# EAGLE design mbedshield037 (EAGLE 7.5.0)
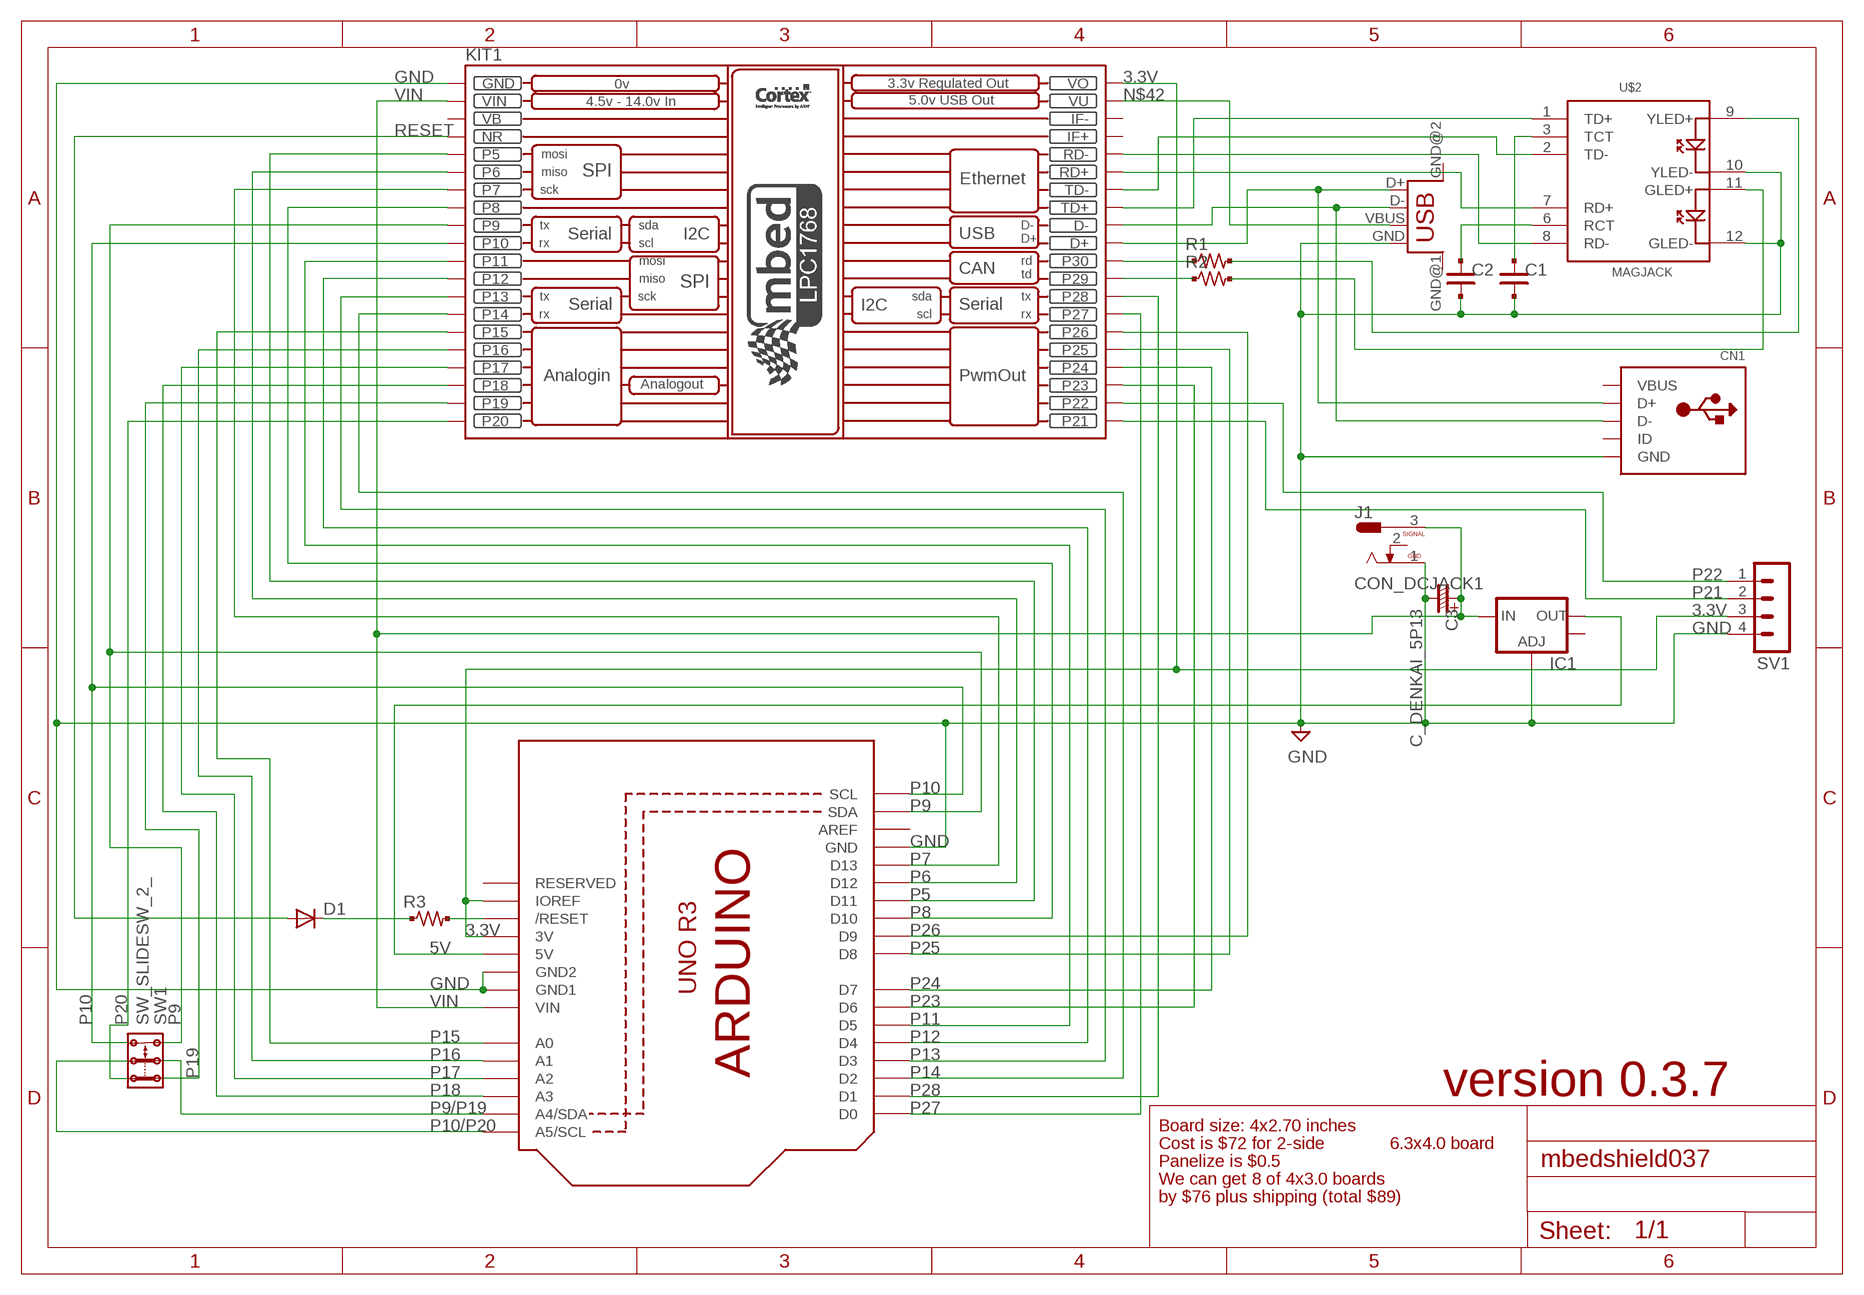
[diagram p0: schematic, sheet 1]

## Parts
C1  C_PAD_PAD_2125  [CR_2125]
C2  C_PAD_PAD_2125  [CR_2125]
C3  C_DENKAI_5P13  C_DENKAI_2.5P6  [C_2.5PHI6]
CN1  USBMINIB  [USB-MINIB]
D1  DIODE_SMALL_FLAT_2V  [DIODE_2125_2VIA]
IC1  V_REG_LM1117SOT223  [SOT223]
J1  CON_DCJACK1  [CON_DCJACK]
KIT1  MBED_NXP_LPC1768  [MBED-KIT]
R1  R_US_PAD_PAD_1608  [R_1608_PADPAD]
R2  R_US_PAD_PAD_1608  [R_1608_PADPAD]
R3  R_US_PAD_PAD_1608  [R_1608_PADPAD]
SV1  MA04-1  [MA04-1]
SW1  SW_SLIDESW_2_  [SW_SLIDE_2X2_1]
U1  ARDUINOR3-DIMENSION  [ARDUINOR3]
U$2  MAGJACK  [MAGJACK]
USB  USB  [USB-FEMALE-A-PTH]

## Nets
3.3V: KIT1.VOUT(VO) SV1.3 U1.3V U1.IOREF
5V: IC1.2(OUT) U1.5V
GND: C1.2 C2.2 C3.- CN1.GND IC1.1(ADJ) J1.1 KIT1.GND SV1.4 U1.GND U1.GND1 U1.GND2 U$2.10(YLED-) U$2.12(GLED-) USB.GND
N$27: D1.K(C) R3.1
N$28: R3.2 U1.RESET(/RESET)
N$29: C1.1 U$2.3(TCT)
N$30: C2.1 U$2.6(RCT)
N$31: KIT1.RD+ U$2.7(RD+)
N$32: KIT1.RD- U$2.8(RD-)
N$33: KIT1.TD- U$2.2(TD-)
N$34: KIT1.TD+ U$2.1(TD+)
N$36: KIT1.P$30(P30) R1.1
N$37: KIT1.P$29(P29) R2.1
N$39: R1.2 U$2.9(YLED+)
N$40: R2.2 U$2.11(GLED+)
N$42: KIT1.VU USB.VBUS
N$44: CN1.D- KIT1.D- USB.D-
N$45: CN1.D+ KIT1.D+ USB.D+
P5: KIT1.P$5(P5) U1.D11
P6: KIT1.P$6(P6) U1.D12
P7: KIT1.P$7(P7) U1.D13
P8: KIT1.P$8(P8) U1.D10
P9: KIT1.P$9(P9) SW1.2.1 U1.SDA
P9/P19: SW1.COM.1 U1.A4(A4/SDA)
P10: KIT1.P$10(P10) SW1.2.2 U1.SCL
P10/P20: SW1.COM.2 U1.A5(A5/SCL)
P11: KIT1.P$11(P11) U1.D5
P12: KIT1.P$12(P12) U1.D4
P13: KIT1.P$13(P13) U1.D3
P14: KIT1.P$14(P14) U1.D2
P15: KIT1.P$15(P15) U1.A0
P16: KIT1.P$16(P16) U1.A1
P17: KIT1.P$17(P17) U1.A2
P18: KIT1.P$18(P18) U1.A3
P19: KIT1.P$19(P19) SW1.1.1
P20: KIT1.P$20(P20) SW1.1.2
P21: KIT1.P$21(P21) SV1.2
P22: KIT1.P$22(P22) SV1.1
P23: KIT1.P$23(P23) U1.D6
P24: KIT1.P$24(P24) U1.D7
P25: KIT1.P$25(P25) U1.D8
P26: KIT1.P$26(P26) U1.D9
P27: KIT1.P$27(P27) U1.D0
P28: KIT1.P$28(P28) U1.D1
RESET: D1.A KIT1.NR
VIN: C3.+ IC1.3(IN) J1.3 KIT1.VIN U1.VIN
Unconnected: CN1.ID IC1.4(OUT) J1.2 KIT1.IF+ KIT1.IF- U1.AREF U1.RESERVED USB.GND@1(GND) USB.GND@2(GND)

## Notes on the sheet
- version 0.3.7
- Board size: 4x2.70 inches
- Cost is $72 for 2-side | 6.3x4.0 board
- Panelize is $0.5
- We can get 8 of 4x3.0 boards
- by $76 plus shipping (total $89)

## Power pins joined to a net without a drawn wire
VB: KIT1.VB
VBUS: CN1.VBUS

## Library data of the parts
C1 C2 = mylib:C_PAD_PAD_: SMD CAPACITOR : PAD - PAD
C3 = mylib:C_DENKAI: (Device name) : (Main function of the device) Packages : (Variant name1) : (Pitch) x (Pin) x (Width) (Variant name2) : (Pitch) x (Pin) x (Width) (Variant name3) : (Pitch) x (Pin) x (Width) ...
CN1 = adafruit (1):USB: USB Connectors USBMINIB - Surface Mount Female Mini-B USB Connector 4UConnector: 06564 By microbuilder.eu Thru-hole RA Female Mini-B USB Connector 4UConnector: 18732 By ladyada.net
D1 = mylib:DIODE_SMALL: DIODE high speed (Philips)
IC1 = SparkFun:V_REG_LM1117: Voltage Regulator LM1117 Standard adjustable voltage regulator but in SMD form. Spark Fun Electronics SKU : COM-00595
J1 = mylib:CON_DCJACK: DC JACK : 2.1 / 2.5 mm
KIT1 = MBED_v2.1:MBED_NXP_LPC1768: Mbed LPC1768 - ARM CORTEX v2.1 * Schematic symbol is now placed in eagles's default raster. *The pads diameter are suitable for routing between mbed pins * mbed pads are 0.8 mm drill diameter. --------------------------------------------- Created by: Mohamed Yousry *Alexandria, Egypt *Email: mohamed.yousry@ieeegoldegypt.org
R1-R3 = mylib:R_US_PAD_PAD: R_US_PAD_PAD : SMD R PAD is NTH-NTH Packages : _1608 : 1.6 x 0.8 mm _2125 : 2.0 x 1.25 mm _3216 : 3.2 x 1.6 mm
SV1 = con-lstb:MA04-1: PIN HEADER; OC_FARNELL: unknown; OC_NEWARK: unknown
SW1 = mylib:SW_SLIDESW_2_
U1 = adafruit (1):ARDUINOR3: This is a new object for the new Arduino R3 - with extra pins that you may want to use (such as IOref, and duplicated A4/A5
U$2 = SparkFun:MAGJACK
USB = STUNTAZ:USB: USB Connectors USB-FEMALE-A-PTH: Through hole Female Type A Connector

## Net classes
0 signal: width 0.406 mm, drill 0.381 mm
1 power: width 0.813 mm, drill 0.381 mm

## Board
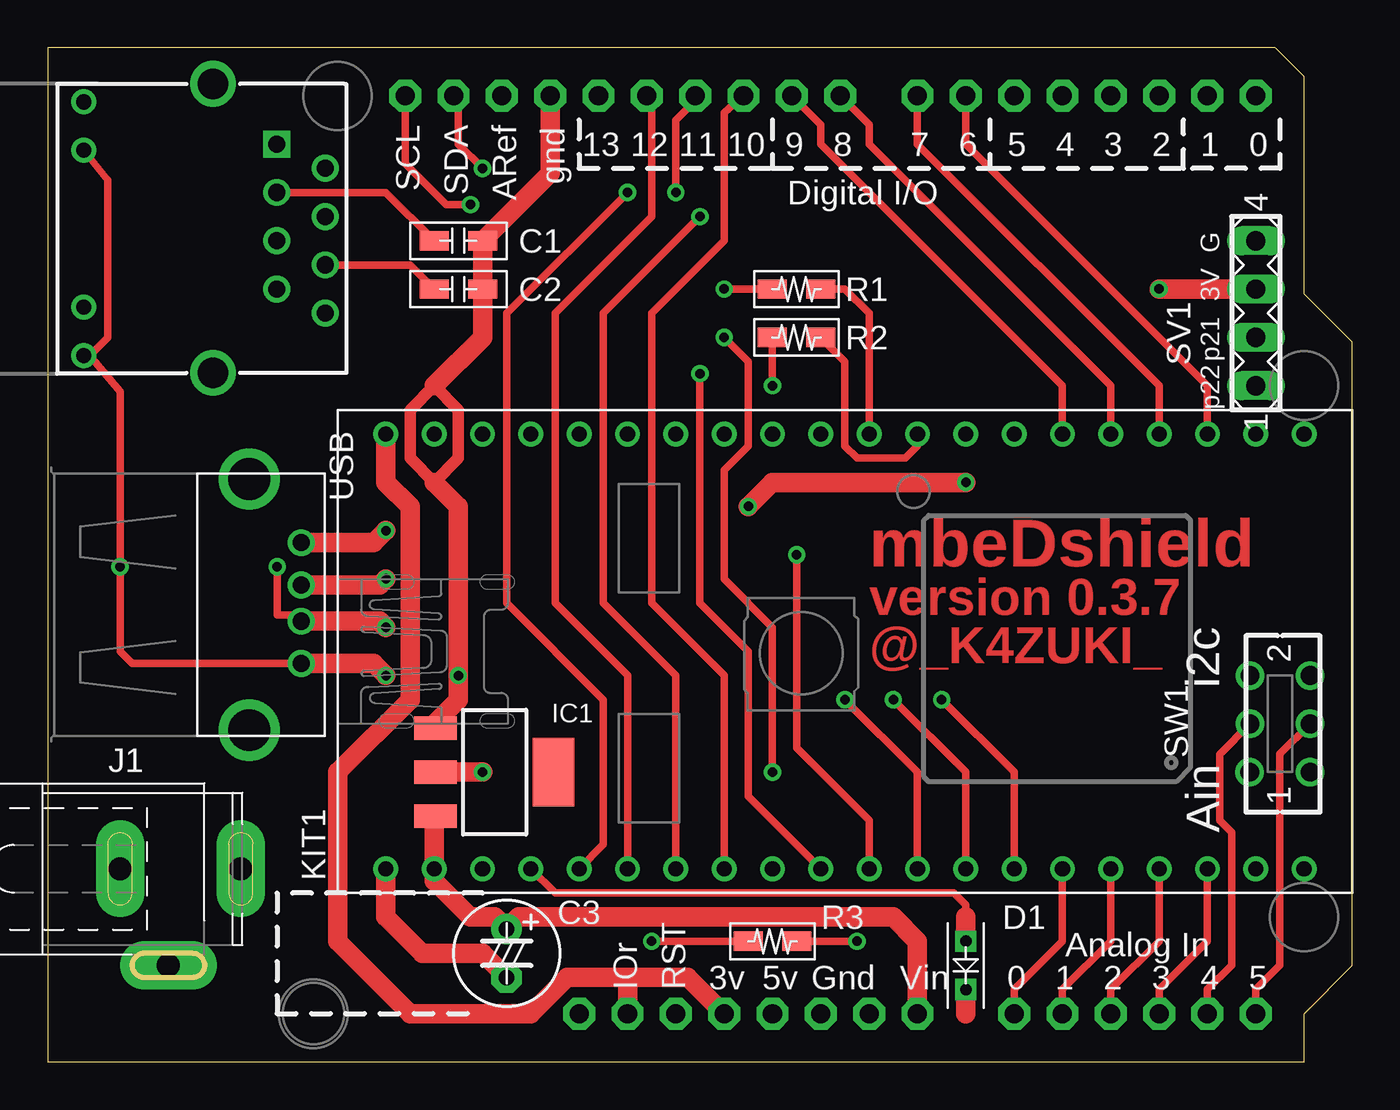
[diagram p1: board, top side]
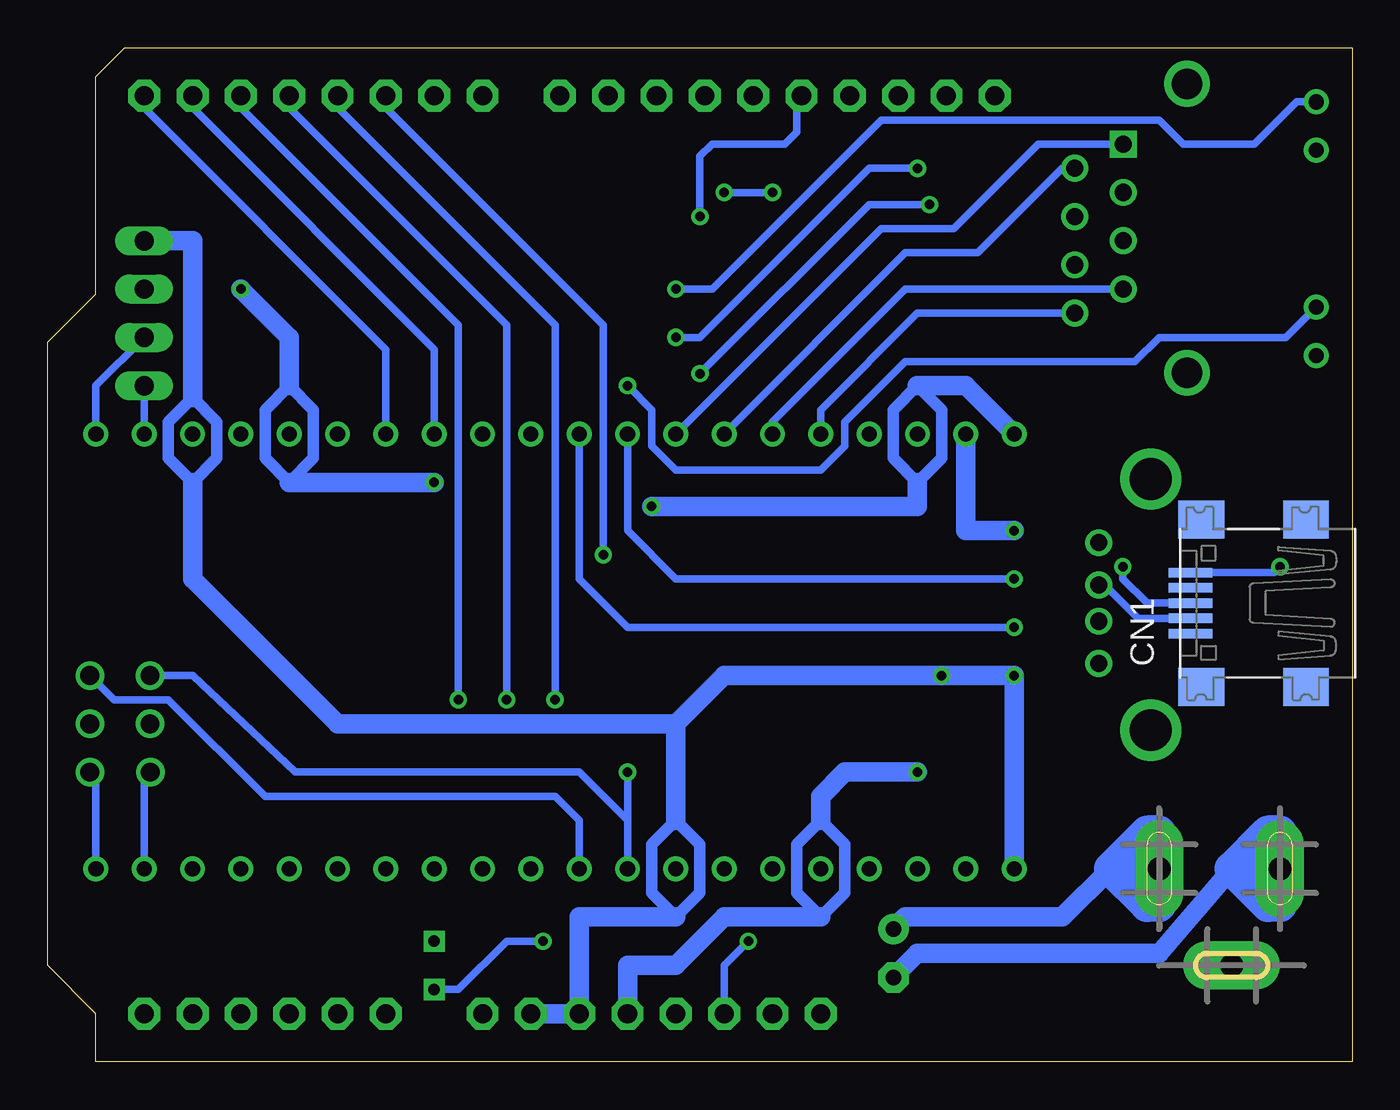
[diagram p2: board, bottom side, seen from below]

Size 68.58 x 53.34 mm. Coordinates in mm from the lower left corner, seen from the top.
Copper layers (1*16): Top 0.0356mm / dielectric 1.5011mm / Bottom 0.0356mm
Design rules "SilverCircuits": minimum track width 10mil, minimum drill 15mil, track to track 8mil, track to pad 8mil, pad to pad 8mil, via to via 8mil, smd to smd 8mil, copper to edge 20mil, drill to drill 8mil, minimum pad ring 10mil, minimum via ring 8mil, stop-mask expansion 4mil, vias tented up to drill 100mil, thermal gap 10mil
Milling: 12 lines

### Footprints (pad centres in the part's own frame; a part is rotated, then mirrored left to right if it is on the bottom)
CR_2125 = smd 1.524 x 1.016: 1 -1.27,0; 2 1.27,0
C_2.5PHI6 = drill 0.813 pad 1.6: + -1.27,0 | drill 0.813 pad 1.6 octagon: - 1.27,0
USB-MINIB = smd 0.5 x 2.308: D+ 0,4.064; D- -0.8,4.064; GND 1.6,4.064; ID 0.8,4.064; VBUS -1.6,4.064 | smd 2 x 2.4: GND1 -4.4,-2; GND2 -4.4,3.5; GND3 4.4,3.5; GND4 4.4,-2
DIODE_2125_2VIA = drill 0.61 square: A 1.27,0; K -1.27,0
SOT223 = smd 1.219 x 2.235: 1 -2.311,-3.099; 2 0,-3.099; 3 2.311,-3.099 | smd 3.6 x 2.2: 4 0,3.099
CON_DCJACK = drill 1.2 pad 2.54 long: 1 -0.635,0; 2 1.905,-5.08; 3 5.715,0
MBED-KIT = drill 0.8: D+ 11.43,1.27; D- 11.43,3.81; GND -11.43,24.13; IF+ 11.43,16.51; IF- 11.43,19.05; NR -11.43,16.51; P$5 -11.43,13.97; P$6 -11.43,11.43; P$7 -11.43,8.89; P$8 -11.43,6.35; P$9 -11.43,3.81; P$10 -11.43,1.27; P$11 -11.43,-1.27; P$12 -11.43,-3.81; P$13 -11.43,-6.35; P$14 -11.43,-8.89; P$15 -11.43,-11.43; P$16 -11.43,-13.97; P$17 -11.43,-16.51; P$18 -11.43,-19.05; P$19 -11.43,-21.59; P$20 -11.43,-24.13; P$21 11.43,-24.13; P$22 11.43,-21.59; P$23 11.43,-19.05; P$24 11.43,-16.51; P$25 11.43,-13.97; P$26 11.43,-11.43; P$27 11.43,-8.89; P$28 11.43,-6.35; P$29 11.43,-3.81; P$30 11.43,-1.27; RD+ 11.43,11.43; RD- 11.43,13.97; TD+ 11.43,6.35; TD- 11.43,8.89; VB -11.43,19.05; VIN -11.43,21.59; VOUT 11.43,24.13; VU 11.43,21.59
R_1608_PADPAD = smd 1.524 x 1.016: 1 -1.27,0; 2 1.27,0
MA04-1 = drill 1.016 long: 1 -3.81,0; 2 -1.27,0; 3 1.27,0; 4 3.81,0
SW_SLIDE_2X2_1 = drill 0.991: 1.1 -2.54,1.587; 1.2 -2.54,-1.587; 2.1 2.54,1.575; 2.2 2.54,-1.587; COM.1 0,1.575; COM.2 0,-1.587
ARDUINOR3 = drill 1 pad 1.676 octagon: 3V 35.56,2.54; 5V 38.1,2.54; A0 50.8,2.54; A1 53.34,2.54; A2 55.88,2.54; A3 58.42,2.54; A4 60.96,2.54; A5 63.5,2.54; AREF 23.876,50.8; D0 63.5,50.8; D1 60.96,50.8; D2 58.42,50.8; D3 55.88,50.8; D4 53.34,50.8; D5 50.8,50.8; D6 48.26,50.8; D7 45.72,50.8; D8 41.656,50.8; D9 39.116,50.8; D10 36.576,50.8; D11 34.036,50.8; D12 31.496,50.8; D13 28.956,50.8; GND 26.416,50.8; GND1 43.18,2.54; GND2 40.64,2.54; IOREF 30.48,2.54; RESERVED 27.94,2.54; RESET 33.02,2.54; SCL 18.796,50.8; SDA 21.336,50.8; VIN 45.72,2.54
MAGJACK = drill 0.9 square: 1 2.54,17.762 | drill 0.9: 2 3.81,20.302; 3 5.08,17.762; 4 6.35,20.302; 5 7.62,17.762; 6 8.89,20.302; 7 10.16,17.762; 8 11.43,20.302 | drill 0.8: 9 0.318,7.62; 10 2.857,7.62; 11 11.113,7.62; 12 13.652,7.62 | drill 1.6 pad 2.184: M1 -0.635,14.418; M2 14.565,14.418
USB-FEMALE-A-PTH = drill 0.9: D+ -0.953,0; D- 0.953,0; GND -3.175,0; VBUS 3.175,0 | drill 2.2: GND@1 6.515,2.73; GND@2 -6.685,2.73

### Placement (x,y rotation side)
C1  21.59,43.18 0 top
C2  21.59,40.64 0 top
C3  24.13,5.71 270 top
CN1  4.45,24.13 90 bottom
D1  48.26,5.08 90 top
IC1  23.5,15.24 270 top
J1  4.45,10.16 0 top
KIT1  41.91,21.59 90 top
R1  39.37,40.64 180 top
R2  39.37,38.1 180 top
R3  38.1,6.35 180 top
SV1  63.5,39.37 90 top
SW1  64.77,17.78 90 top
U1  0,0 0 top
U$2  -5.71,50.8 270 top
USB  13.34,24.13 90 top

### Tracks (layer width: path | path; a pad name or v marks a point on that pad's centre or on a via)
3.3V  (via drill 0.5)
  Top 1.016: KIT1.VOUT 17.78,30.48 19.05,29.21 19.05,19.05 15.24,15.24 15.24,6.35 19.05,2.54 25.4,2.54 27.3,4.45 30.48,4.45 | 30.48,4.45 33.66,4.45 U1.3V | v58.42,40.64 SV1.3 | v48.26,30.48 38.1,30.48 v36.83,29.21 | 30.48,4.45 U1.IOREF
  Bottom 0.61: 54.61,34.29 55.88,35.56 57.15,34.29 57.15,31.75 55.88,30.48 54.61,31.75 54.61,34.29 | 24.13,31.75 22.86,30.48 21.59,31.75 21.59,34.29 22.86,35.56 24.13,34.29 24.13,31.75
  Bottom 1.016: v58.42,40.64 55.88,38.1 55.88,35.56 | v48.26,30.48 55.88,30.48 | v36.83,29.21 22.86,29.21 22.86,30.48 | 22.86,35.56 20.32,35.56 KIT1.VOUT
5V  (via drill 0.5)
  Top 1.016: v22.86,15.24 IC1.2
  Bottom 0.61: 26.67,8.89 27.94,7.62 29.21,8.89 29.21,11.43 27.94,12.7 26.67,11.43 26.67,8.89
  Bottom 1.016: 27.94,7.62 33.02,7.62 35.56,5.08 38.1,5.08 U1.5V | 27.94,12.7 27.94,13.97 26.67,15.24 v22.86,15.24
GND  (via drill 0.5)
  Top 0.406: USB.GND 4.45,20.95 3.81,21.59 v3.81,26.04 3.81,35.24 2.22,37.15 | U$2.10 3.17,46.35 3.17,38.1 2.22,37.15 | 2.22,37.15 U$2.12
  Top 0.61: 20.32,30.48 19.05,31.75 19.05,34.29 20.32,35.56 21.59,34.29 21.59,31.75 20.32,30.48
  Top 1.016: 20.32,35.56 22.86,38.1 C2.2 C1.2 26.42,46.74 U1.GND | 20.32,30.48 21.59,29.21 v21.59,20.32 21.59,19.05 20.32,17.78 20.32,17.63 IC1.1 | C3.- 22.86,5.71 19.68,5.71 17.78,7.62 KIT1.GND | USB.GND 17.14,20.95 v17.78,20.32
  Bottom 0.406: v3.81,26.04 4.12,25.73 CN1.GND
  Bottom 0.61: 34.29,11.43 34.29,8.89 35.56,7.62 36.83,8.89 36.83,11.43 35.56,12.7 34.29,11.43 | 59.69,33.66 60.96,34.92 62.23,33.66 62.23,31.75 60.96,30.48 59.69,31.75 59.69,33.66
  Bottom 1.016: 35.56,7.62 40.64,7.62 U1.GND2 U1.GND1 | KIT1.GND v17.78,20.32 v21.59,20.32 33.02,20.32 35.56,17.78 | 35.56,17.78 35.56,12.7 | 6.35,10.16 10.16,5.71 22.86,5.71 C3.- | 60.96,30.48 60.96,25.4 53.34,17.78 35.56,17.78 | 60.96,34.92 60.96,43.18 SV1.4
  Bottom 1.778: 6.35,10.16 4.45,12.06 3.81,12.06 J1.1 | 6.35,10.16 4.45,8.26 3.81,8.26 J1.1 | J1.1 6.35,10.16
N$27  (via drill 0.5)
  Top 0.406: R3.1 v42.55,6.35
  Top 1.016: D1.K 48.26,2.54
  Bottom 0.406: v42.55,6.35 44.45,6.35 46.99,3.81 D1.K
N$28  (via drill 0.5)
  Top 0.406: v31.75,6.35 R3.2
  Bottom 0.406: U1.RESET 33.02,5.08 v31.75,6.35
N$29
  Top 0.406: U$2.3 17.78,45.72 C1.1
N$30
  Top 0.406: U$2.6 19.05,41.91 C2.1
N$31
  Bottom 0.406: U$2.7 23.5,40.64 30.48,33.66 KIT1.RD+
N$32
  Bottom 0.406: KIT1.RD- 27.94,34.29 22.86,39.37 U$2.8
N$33
  Bottom 0.406: U$2.2 15.24,46.99 19.68,42.55 23.5,42.55 KIT1.TD-
N$34
  Bottom 0.406: KIT1.TD+ 24.77,43.81 20.95,43.81 16.51,48.26 U$2.1
N$36
  Top 0.406: KIT1.P$30 43.18,39.37 41.91,40.64 R1.1
N$37
  Top 0.406: KIT1.P$29 45.72,32.38 45.09,31.75 42.55,31.75 41.91,32.38 41.91,36.83 R2.1
N$39  (via drill 0.5)
  Top 0.406: v35.56,40.64 R1.2
  Bottom 0.406: U$2.9 2.92,50.48 5.15,48.26 8.89,48.26 10.16,49.53 24.77,49.53 33.66,40.64 v35.56,40.64
N$40  (via drill 0.5)
  Top 0.406: v38.1,35.56 R2.2
  Bottom 0.406: v38.1,35.56 36.83,34.29 36.83,32.38 35.56,31.11 27.94,31.11 26.67,32.38 26.67,33.66 23.5,36.83 11.43,36.83 10.16,38.1 3.49,38.1 U$2.11
N$42  (via drill 0.5)
  Top 1.016: USB.VBUS 17.14,27.3 v17.78,27.94
  Bottom 1.016: KIT1.VU 20.32,27.94 v17.78,27.94
N$44  (via drill 0.5)
  Top 1.016: USB.D- 17.46,25.08 v17.78,25.4
  Bottom 0.406: KIT1.D- 38.1,27.94 35.56,25.4 v17.78,25.4 | USB.D- 13.02,25.08 11.27,23.33 CN1.D-
N$45  (via drill 0.5)
  Top 0.406: USB.D+ 13.02,23.5 12.06,23.5 v12.06,26.04
  Top 1.016: USB.D+ 17.46,23.18 v17.78,22.86
  Bottom 0.406: KIT1.D+ 40.64,25.4 38.1,22.86 v17.78,22.86 | v12.06,26.04 12.06,25.4 10.79,24.13 CN1.D+
P5  (via drill 0.5)
  Top 0.406: KIT1.P$5 29.21,11.43 29.21,19.05 24.13,24.13 24.13,39.37 v30.48,45.72 | v33.02,45.72 33.02,49.53 34.04,50.55 U1.D11
  Bottom 0.406: v30.48,45.72 v33.02,45.72
P6
  Top 0.406: KIT1.P$6 30.48,20.32 26.67,24.13 26.67,39.37 31.75,44.45 31.75,50.55 U1.D12
P7  (via drill 0.5)
  Top 0.406: KIT1.P$7 33.02,20.32 29.21,24.13 29.21,39.37 v34.29,44.45
  Bottom 0.406: v34.29,44.45 34.29,47.62 33.66,48.26 29.84,48.26 29.21,48.9 29.21,50.55 U1.D13
P8
  Top 0.406: KIT1.P$8 35.56,20.32 31.75,24.13 31.75,39.37 35.56,43.18 35.56,49.91 U1.D10
P9  (via drill 0.5)
  Top 0.406: v38.1,15.24 38.1,22.86 35.56,25.4 35.56,31.11 36.83,32.38 36.83,36.83 v35.56,38.1 | v22.86,46.99 21.59,48.26 21.59,50.55 U1.SDA
  Bottom 0.406: v35.56,38.1 34.29,38.1 25.4,46.99 v22.86,46.99 | KIT1.P$9 38.1,12.7 | 38.1,12.7 40.64,15.24 55.58,15.24 60.96,20.32 SW1.2.1 | 38.1,12.7 v38.1,15.24
P9/P19
  Top 0.406: U1.A4 60.96,3.81 62.23,5.08 62.23,12.06 61.59,12.7 61.59,16.18 SW1.COM.1
P10  (via drill 0.5)
  Top 0.406: KIT1.P$10 36.83,13.97 36.83,21.59 34.29,24.13 v34.29,36.2 | U1.SCL 18.8,47.24 20.95,45.09 v22.23,45.09
  Bottom 0.406: v22.23,45.09 25.4,45.09 v34.29,36.2 | KIT1.P$10 40.64,12.7 41.91,13.97 57.15,13.97 62.23,19.05 65.09,19.05 SW1.2.2
P10/P20
  Top 0.406: U1.A5 63.5,3.81 64.77,5.08 64.77,16.19 SW1.COM.2
P11  (via drill 0.5)
  Top 0.406: KIT1.P$11 43.18,12.7 39.37,16.51 v39.37,26.67
  Bottom 0.406: v39.37,26.67 39.37,38.73 50.8,50.16 U1.D5
P12  (via drill 0.5)
  Top 0.406: KIT1.P$12 45.72,15.24 v41.91,19.05
  Bottom 0.406: v41.91,19.05 41.91,38.73 53.34,50.16 U1.D4
P13  (via drill 0.5)
  Top 0.406: KIT1.P$13 48.26,15.24 v44.45,19.05
  Bottom 0.406: v44.45,19.05 44.45,38.73 55.88,50.16 U1.D3
P14  (via drill 0.5)
  Top 0.406: KIT1.P$14 50.8,15.24 v46.99,19.05
  Bottom 0.406: v46.99,19.05 46.99,38.73 58.42,50.16 U1.D2
P15
  Top 0.406: KIT1.P$15 53.34,6.35 50.8,3.81 U1.A0
P16
  Top 0.406: KIT1.P$16 55.88,6.35 53.34,3.81 U1.A1
P17
  Top 0.406: KIT1.P$17 58.42,6.35 55.88,3.81 U1.A2
P18
  Top 0.406: KIT1.P$18 60.96,6.35 58.42,3.81 U1.A3
P19
  Bottom 0.406: KIT1.P$19 63.5,14.92 SW1.1.1
P20
  Bottom 0.406: KIT1.P$20 66.04,14.92 SW1.1.2
P21
  Bottom 0.406: KIT1.P$21 66.04,35.56 SV1.2
P22
  Bottom 0.406: KIT1.P$22 SV1.1
P23
  Top 0.406: KIT1.P$23 60.96,35.56 48.26,48.26 U1.D6
P24
  Top 0.406: KIT1.P$24 58.42,35.56 45.72,48.26 U1.D7
P25
  Top 0.406: KIT1.P$25 55.88,35.56 43.18,48.26 43.18,49.28 U1.D8
P26
  Top 0.406: KIT1.P$26 53.34,35.56 40.64,48.26 40.64,49.28 U1.D9
P27
  Bottom 0.406: KIT1.P$27 50.8,37.47 63.5,50.16 U1.D0
P28
  Bottom 0.406: KIT1.P$28 48.26,37.47 60.96,50.16 U1.D1
RESET
  Top 0.406: KIT1.NR 26.67,8.89 47.62,8.89 48.26,8.26 48.26,7.62
  Top 1.016: 48.26,7.62 D1.A
VIN
  Top 1.016: IC1.3 20.32,12.85 KIT1.VIN 20.32,9.53 22.23,7.62 23.5,7.62 C3.+ 24.77,7.62 44.45,7.62 45.72,6.35 U1.VIN
  Bottom 1.016: 12.7,10.16 15.24,7.62 23.5,7.62 C3.+
  Bottom 1.778: 12.7,10.16 10.79,8.26 10.16,8.26 J1.3 | 12.7,10.16 10.79,12.06 10.16,12.06 J1.3 | J1.3 12.7,10.16

### Text on the board
Top: mbeDshield | version 0.3.7 | @_K4ZUKI_
tPlace: G | 3V | p21 | p22 | i2c | Ain